# EAGLE schematic triggerbox (EAGLE 9.6.2)
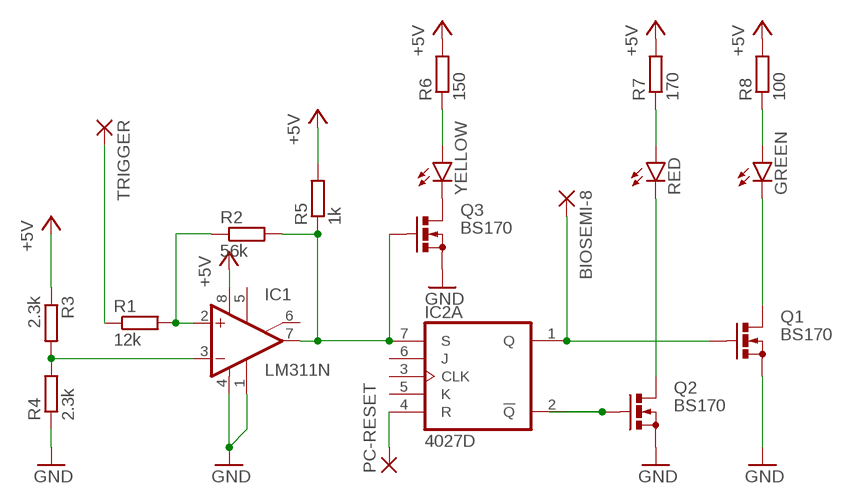
[diagram p0: schematic, sheet 1]

## Parts
BIOSEMI-8  WIREPAD1,6/0,8  [1,6/0,8]
GREEN  LED5MM  [LED5MM]
IC1  LM311N  [DIL08]
IC2  4027D  [SO16]
PC-RESET  WIREPAD1,6/0,8  [1,6/0,8]
Q1  BS170  [SOT54E]
Q2  BS170  [SOT54E]
Q3  BS170  [SOT54E]
R1  12k  R-EU_R0805  [R0805]
R2  56k  R-EU_R0805  [R0805]
R3  2.3k  R-EU_R0805  [R0805]
R4  2.3k  R-EU_R0805  [R0805]
R5  1k  R-EU_R0805  [R0805]
R6  150  R-EU_R0805  [R0805]
R7  170  R-EU_R0805  [R0805]
R8  100  R-EU_R0805  [R0805]
RED  LED5MM  [LED5MM]
TRIGGER  WIREPAD1,6/0,8  [1,6/0,8]
YELLOW  LED5MM  [LED5MM]

## Nets
+5V: IC1.8(V+) R3.1 R5.2 R6.2 R7.2 R8.2
GND: IC1.1(GND) IC1.4(V-) Q1.S Q2.S Q3.S R4.1
N$1: IC1.3(-IN) R3.2 R4.2
N$2: IC1.2(+IN) R1.2 R2.1
N$3: IC1.7(OUT) IC2.7(A:S) Q3.G R2.2 R5.1
N$4: IC2.2(A:!Q) Q2.G
N$5: R1.1 TRIGGER.1(P)
N$6: IC2.4(A:R) PC-RESET.1(P)
N$7: BIOSEMI-8.1(P) IC2.1(A:Q) Q1.G
N$8: Q3.D YELLOW.K(C)
N$9: R6.1 YELLOW.A
N$10: R7.1 RED.A
N$11: GREEN.A R8.1
N$12: Q2.D RED.K(C)
N$13: GREEN.K(C) Q1.D
Unconnected: IC1.5(ON) IC1.6(ON/STR) IC2.3(A:CLK) IC2.5(A:K) IC2.6(A:J) IC2.9(B:S) IC2.10(B:J) IC2.11(B:K) IC2.12(B:R) IC2.13(B:CLK) IC2.14(B:!Q) IC2.15(B:Q)

## Power pins joined to a net without a drawn wire
VDD: IC2.16(P:VDD)
VSS: IC2.8(P:VSS)

## Library data of the parts
BIOSEMI-8 PC-RESET TRIGGER = wirepad:WIREPAD: Wire PAD connect wire on PCB
GREEN RED YELLOW = led:LED: LED OSRAM: - CHIPLED LG R971, LG N971, LY N971, LG Q971, LY Q971, LO R971, LY R971 LH N974, LH R974 LS Q976, LO Q976, LY Q976 LO Q996 - Hyper CHIPLED LW Q18S LB Q993, LB Q99A, LB R99A - SideLED LS A670, LO A670, LY A670, LG A670, LP A670 LB A673, LV A673, LT A673, LW A673 LH A674 LY A675 LS A676, LA A676, LO A676, LY A676, LW A676 LS A679, LY A679, LG A679 - Hyper Micro SIDELED® LS Y876, LA Y876, LO Y876, LY Y876 LT Y87S - SmartLED LW L88C, LW L88S LB L89C, LB L89S, LG L890 LS L89K, LO L89K, LY L89K LS L896, LA L896, LO L896, LY L896 - TOPLED LS T670, LO T670, LY T670, LG T670, LP T670 LSG T670, LSP T670, LSY T670, LOP T670, LYG T670 LG T671, LOG T671, LSG T671 LB T673, LV T673, LT T673, LW T673 LH T674 LS T676, LA T676, LO T676, LY T676, LB T676, LH T676, LSB T676, LW T676 LB T67C, LV T67C, LT T67C, LS T67K, LO T67K, LY T67K, LW E67C LS E67B, LA E67B, LO E67B, LY E67B, LB E67C, LV E67C, LT E67C LW T67C LS T679, LY T679, LG T679 LS T770, LO T770, LY T770, LG T770, LP T770 LB T773, LV T773, LT T773, LW T773 LH T774 LS E675, LA E675, LY E675, LS T675 LS T776, LA T776, LO T776, LY T776, LB T776 LHGB T686 LT T68C, LB T68C - Hyper Mini TOPLED® LB M676 - Mini TOPLED Santana® LG M470 LS M47K, LO M47K, LY M47K Source: http://www.osram.convergy.de LUXEON: - LUMILED® LXK2-PW12-R00, LXK2-PW12-S00, LXK2-PW14-U00, LXK2-PW14-V00 LXK2-PM12-R00, LXK2-PM12-S00, LXK2-PM14-U00 LXK2-PE12-Q00, LXK2-PE12-R00, LXK2-PE12-S00, LXK2-PE14-T00, LXK2-PE14-U00 LXK2-PB12-K00, LXK2-PB12-L00, LXK2-PB12-M00, LXK2-PB14-N00, LXK2-PB14-P00, LXK2-PB14-Q00 LXK2-PR12-L00, LXK2-PR12-M00, LXK2-PR14-Q00, LXK2-PR14-R00 LXK2-PD12-Q00, LXK2-PD12-R00, LXK2-PD12-S00 LXK2-PH12-R00, LXK2-PH12-S00 LXK2-PL12-P00, LXK2-PL12-Q00, LXK2-PL12-R00 Source: www.luxeon.com KINGBRIGHT: KA-3528ASYC Source: www.kingbright.com
IC1 = linear:LM311: COMPARATOR
IC2 = 40xx:4027: Dual JK FLIP FLOP
Q1-Q3 = transistor-small-signal:BS170: N-CHANNEL MOS FET
R1-R8 = rcl:R-EU_: RESISTOR, European symbol; SPICEPREFIX: R